# EAGLE design keyboard_trans_flipped (EAGLE 7.4.0)
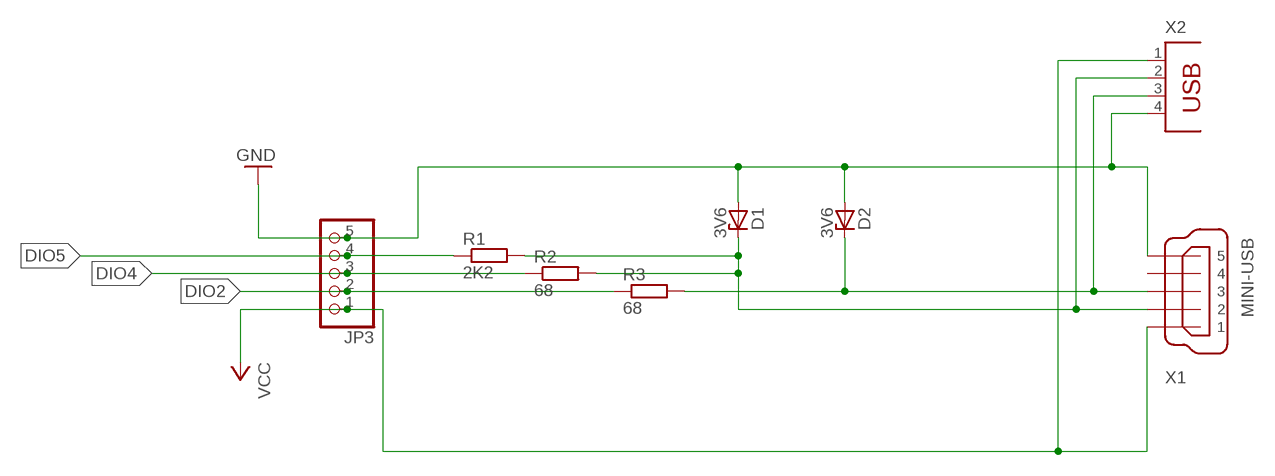
[diagram p0: schematic, sheet 1]

## Parts
D1  3V6  ZPD  [DO35Z10]
D2  3V6  ZPD  [DO35Z10]
JP3  PINHD-1X5  [1X05]
R1  2K2  R-EU_0204/5  [0204/5]
R2  68  R-EU_0204/5  [0204/5]
R3  68  R-EU_0204/5  [0204/5]
X1  MINI-USB  MINI-USB-UX60-MB-5S8  [UX60-MB-5S8]
X2  PN61729  [PN61729]

## Nets
DIO2: JP3.2 R3.1
DIO4: JP3.3 R2.1
DIO5: JP3.4 R1.1
GND: D1.A D2.A JP3.5 X1.5 X2.4
N$4: D1.C R1.2 R2.2 X1.2 X2.2
N$6: D2.C R3.2 X1.3 X2.3
VCC: JP3.1 X1.1 X2.1
Unconnected: X1.4

## Library data of the parts
D1 D2 = diode:ZPD: Z DIODE 500 mW
JP3 = pinhead:PINHD-1X5: PIN HEADER
R1-R3 = resistor:R-EU_: RESISTOR, European symbol
X1 = con-hirose:MINI-USB-: MINI USB Connector Source: http://www.hirose.co.jp/cataloge_hp/e24000019.pdf; OC_FARNELL: unknown; OC_NEWARK: unknown
X2 = con-berg:PN61729: BERG USB connector; OC_FARNELL: unknown; OC_NEWARK: unknown

## Board
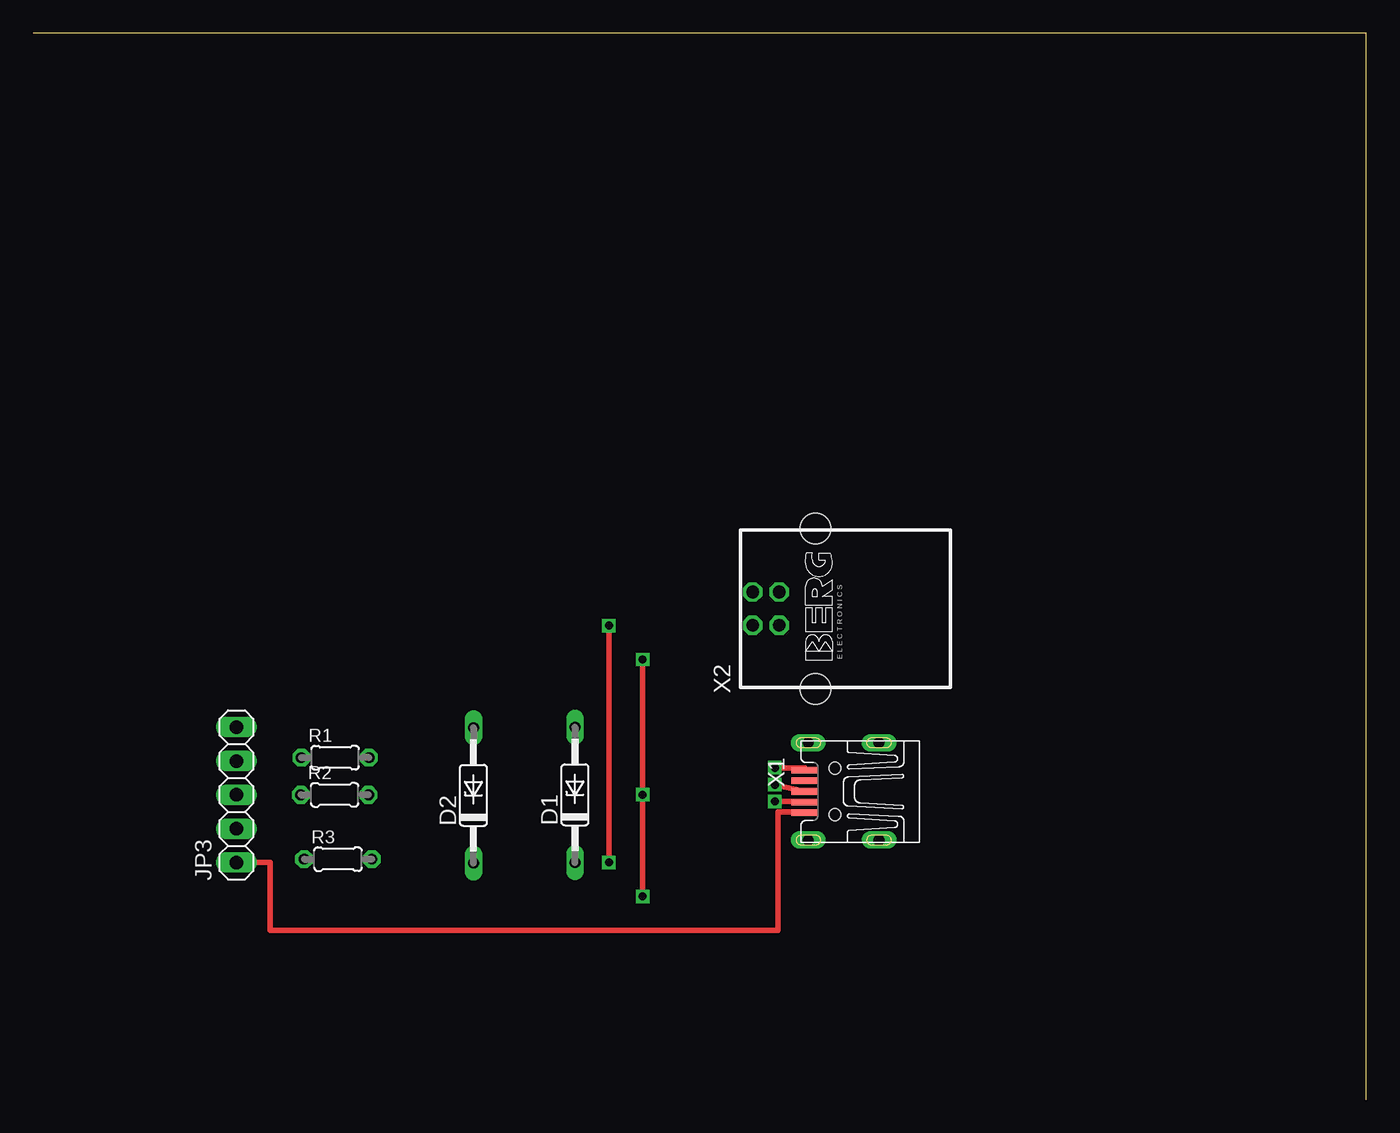
[diagram p1: board, top side]
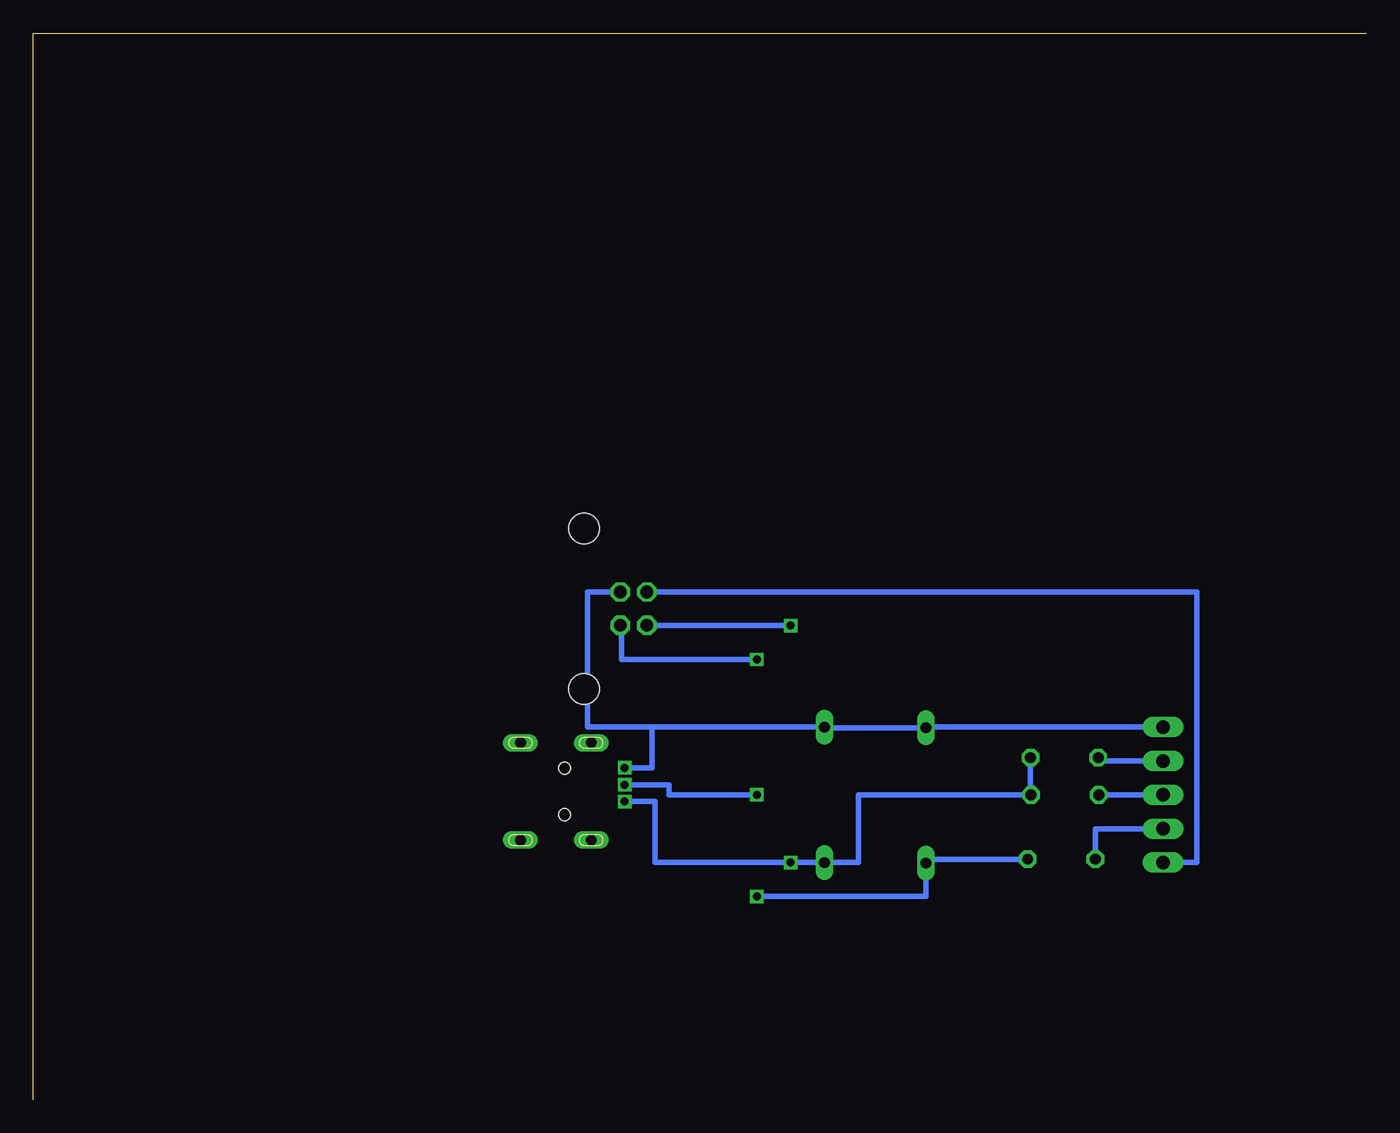
[diagram p2: board, bottom side, seen from below]

Size 100 x 80 mm. Coordinates in mm from the lower left corner, seen from the top.
Outline: 100,0 100,80 0,80
Copper layers (1*16): Top 0.035mm / dielectric 1.5mm / Bottom 0.035mm
Design rules "default": minimum track width 10mil, minimum drill 24mil, track to track 8mil, track to pad 8mil, pad to pad 8mil, via to via 8mil, smd to smd 8mil, copper to edge 40mil, drill to drill 8mil, minimum pad ring 10mil, minimum via ring 8mil, stop-mask expansion 4mil, vias tented up to drill 0mil, thermal gap 10mil

### Footprints (pad centres in the part's own frame; a part is rotated, then mirrored left to right if it is on the bottom)
DO35Z10 = drill 0.813 long: A 5.08,0; C -5.08,0
1X05 = drill 1.016 long: 1 -5.08,0; 2 -2.54,0; 3 0,0; 4 2.54,0; 5 5.08,0
0204/5 = drill 0.813 octagon: 1 -2.54,0; 2 2.54,0
UX60-MB-5S8 = smd 2 x 0.5: 1 8.65,1.6; 2 8.65,0.8; 3 8.65,0; 4 8.65,-0.8; 5 8.65,-1.6 | drill 0.8 long: M1 3.1,-3.65; M2 3.1,3.65; M3 8.4,3.65; M4 8.4,-3.65 | hole 0.9: 6.4,-1.75; 6.4,1.75
PN61729 = drill 0.95 octagon: 1 1.25,4.71; 2 -1.25,4.71; 3 -1.25,2.71; 4 1.25,2.71 | hole 2.3: -6.02,0; 6.02,0

### Placement (x,y rotation side)
D1  40.64,22.86 90 top
D2  33.02,22.82 90 top
JP3  15.24,22.86 90 top
R1  22.65,25.65 0 top
R2  22.61,22.86 0 top
R3  22.86,18.03 0 top
X1  66.55,23.11 180 top
X2  58.67,36.83 90 top

### Tracks (layer width: path | path; a pad name or v marks a point on that pad's centre or on a via)
DIO2
  Bottom 0.406: JP3.2 20.32,20.32 R3.1
DIO4
  Bottom 0.406: JP3.3 R2.1
DIO5
  Bottom 0.406: JP3.4 20.11,25.4 R1.1
GND  (via drill 0.6)
  Top 0.406: v55.63,24.89 57.9,24.89 X1.5
  Bottom 0.406: JP3.5 33.02,27.94 D2.A 40.64,27.9 D1.A 53.59,27.94 | 53.59,27.94 53.59,24.89 v55.63,24.89 | X2.4 58.42,38.08 58.42,27.94 53.59,27.94
N$1  (via drill 0.6)
  other vias: 45.72,15.24
N$2  (via drill 0.6)
  other vias: 45.72,22.86
N$4  (via drill 0.6)
  Top 0.406: v55.63,22.35 57.9,22.35 X1.2 | v43.18,35.56 v43.18,17.78
  Bottom 0.406: R1.2 25.19,22.86 | 25.19,22.86 R2.2 | 25.19,22.86 38.1,22.86 38.1,17.78 D1.C v43.18,17.78 53.34,17.78 53.34,22.35 v55.63,22.35 | X2.2 43.18,35.58 v43.18,35.56
N$5  (via drill 0.6)
  other vias: 55.63,23.62
N$6  (via drill 0.6)
  Top 0.406: v45.72,15.24 v45.72,22.86 v45.72,33.02 | v55.63,23.62 X1.3
  Bottom 0.406: R3.2 33.02,18.03 D2.C 33.02,15.24 v45.72,15.24 | v45.72,22.86 52.32,22.86 52.32,23.62 v55.63,23.62 | X2.3 55.88,35.58 55.88,33.02 v45.72,33.02
N$7  (via drill 0.6)
  other vias: 43.18,35.56
N$8  (via drill 0.6)
  other vias: 45.72,33.02
N$15  (via drill 0.6)
  other vias: 55.63,22.35
N$16  (via drill 0.6)
  other vias: 55.63,24.89
VCC
  Top 0.406: JP3.1 17.78,17.78 17.78,12.7 55.88,12.7 55.88,21.59 57.9,21.59 X1.1
  Bottom 0.406: X2.1 12.7,38.08 | 12.7,38.08 12.7,38.1 | 12.7,38.08 12.7,17.78 JP3.1